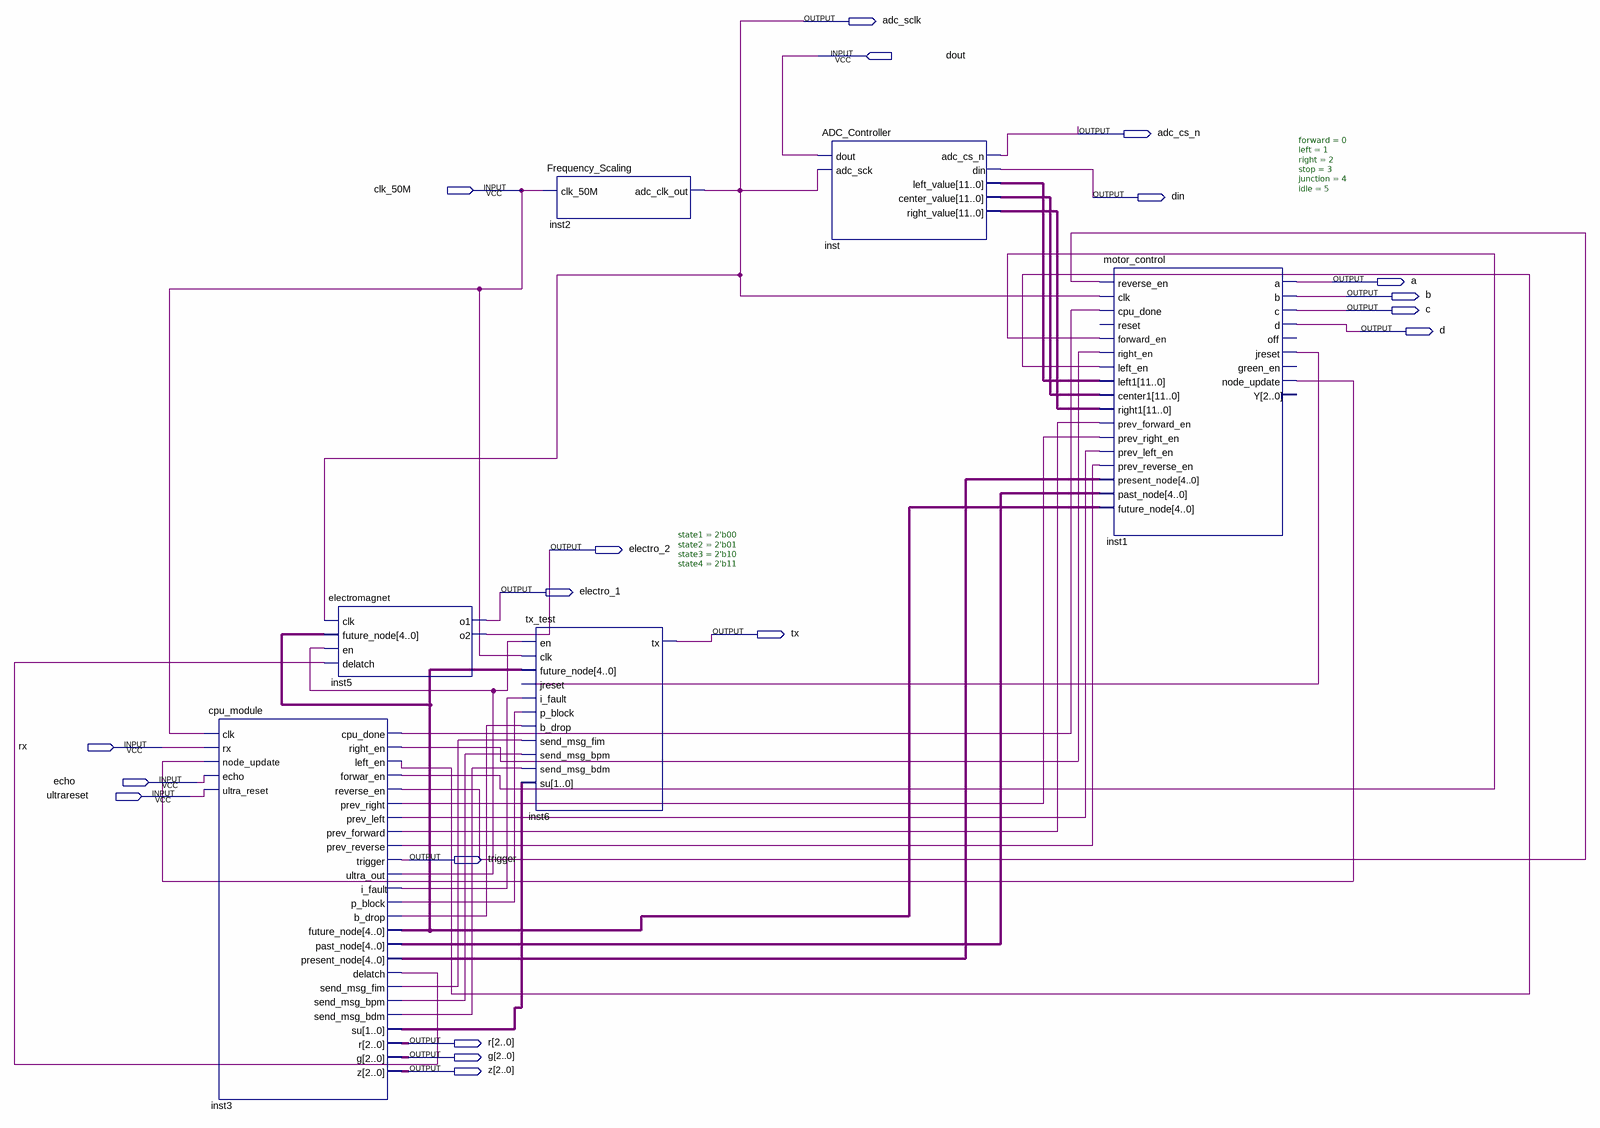
[diagram p0: schematic sheet]
// Quartus schematic AB_LFA_Tester.bdf as structural Verilog: 6 symbols, 19 pins
module AB_LFA_Tester (
  input  dout,
  input  clk_50M,
  input  rx,
  input  echo,
  input  ultrareset,
  output adc_sclk,
  output adc_cs_n,
  output din,
  output a,
  output b,
  output c,
  output d,
  output electro_2,
  output electro_1,
  output tx,
  output trigger,
  output [2:0] r,
  output [2:0] g,
  output [2:0] z
);

  wire inst1_jreset, inst1_node_update, inst3_b_drop, inst3_cpu_done, inst3_delatch, inst3_forwar_en,
       inst3_i_fault, inst3_left_en, inst3_p_block, inst3_prev_forward, inst3_prev_left, inst3_prev_reverse,
       inst3_prev_right, inst3_reverse_en, inst3_right_en, inst3_send_msg_bdm, inst3_send_msg_bpm,
       inst3_send_msg_fim, inst3_ultra_out;
  wire [1:0] inst3_su;
  wire [4:0] inst3_future_node, inst3_past_node, inst3_present_node;
  wire [11:0] inst_center_value, inst_left_value, inst_right_value;

  cpu_module inst3 (
    .clk(clk_50M), .rx(rx), .node_update(inst1_node_update), .echo(echo), .ultra_reset(ultrareset),
    .cpu_done(inst3_cpu_done), .right_en(inst3_right_en), .left_en(inst3_left_en),
    .forwar_en(inst3_forwar_en), .reverse_en(inst3_reverse_en), .prev_right(inst3_prev_right),
    .prev_left(inst3_prev_left), .prev_forward(inst3_prev_forward), .prev_reverse(inst3_prev_reverse),
    .trigger(trigger), .ultra_out(inst3_ultra_out), .i_fault(inst3_i_fault), .p_block(inst3_p_block),
    .b_drop(inst3_b_drop), .future_node(inst3_future_node), .past_node(inst3_past_node),
    .present_node(inst3_present_node), .delatch(inst3_delatch), .send_msg_fim(inst3_send_msg_fim),
    .send_msg_bpm(inst3_send_msg_bpm), .send_msg_bdm(inst3_send_msg_bdm), .su(inst3_su), .r(r), .g(g), .z(z));
  electromagnet inst5 (
    .clk(adc_sclk), .future_node(inst3_future_node), .en(inst3_ultra_out), .delatch(inst3_delatch),
    .o1(electro_1), .o2(electro_2));
  Frequency_Scaling inst2 (.clk_50M(clk_50M), .adc_clk_out(adc_sclk));
  tx_test #(.state1(2'b00), .state2(2'b01), .state3(2'b10), .state4(2'b11)) inst6 (
    .en(inst3_ultra_out), .clk(clk_50M), .future_node(inst3_future_node), .jreset(inst1_jreset),
    .i_fault(inst3_i_fault), .p_block(inst3_p_block), .b_drop(inst3_b_drop),
    .send_msg_fim(inst3_send_msg_fim), .send_msg_bpm(inst3_send_msg_bpm), .send_msg_bdm(inst3_send_msg_bdm),
    .su(inst3_su), .tx(tx));
  ADC_Controller inst (
    .dout(dout), .adc_sck(adc_sclk), .adc_cs_n(adc_cs_n), .din(din), .left_value(inst_left_value),
    .center_value(inst_center_value), .right_value(inst_right_value));
  motor_control #(.forward(0), .left(1), .right(2), .stop(3), .junction(4), .idle(5)) inst1 (
    .reverse_en(inst3_reverse_en), .clk(adc_sclk), .cpu_done(inst3_cpu_done), .forward_en(inst3_forwar_en),
    .right_en(inst3_right_en), .left_en(inst3_left_en), .left1(inst_left_value), .center1(inst_center_value),
    .right1(inst_right_value), .prev_forward_en(inst3_prev_forward), .prev_right_en(inst3_prev_right),
    .prev_left_en(inst3_prev_left), .prev_reverse_en(inst3_prev_reverse), .present_node(inst3_present_node),
    .past_node(inst3_past_node), .future_node(inst3_future_node), .a(a), .b(b), .c(c), .d(d),
    .jreset(inst1_jreset), .node_update(inst1_node_update));  // open: reset, off, green_en, Y
endmodule
